# Altium schematic sheet fans.SchDoc: CS - Fan Switch
size Letter; CheckedBy: J. Brinton; CompanyName: Signal Laboratories, Inc.; DrawnBy: J. Brinton; Engineer: J. Brinton; Address1: 3479 Edison Way; Address2: Menlo Park CA 94025; Address3: +1 (877) 778-8435; Address4: siglabs.com; Revision: 3; SheetNumber: 46; SheetTotal: 47
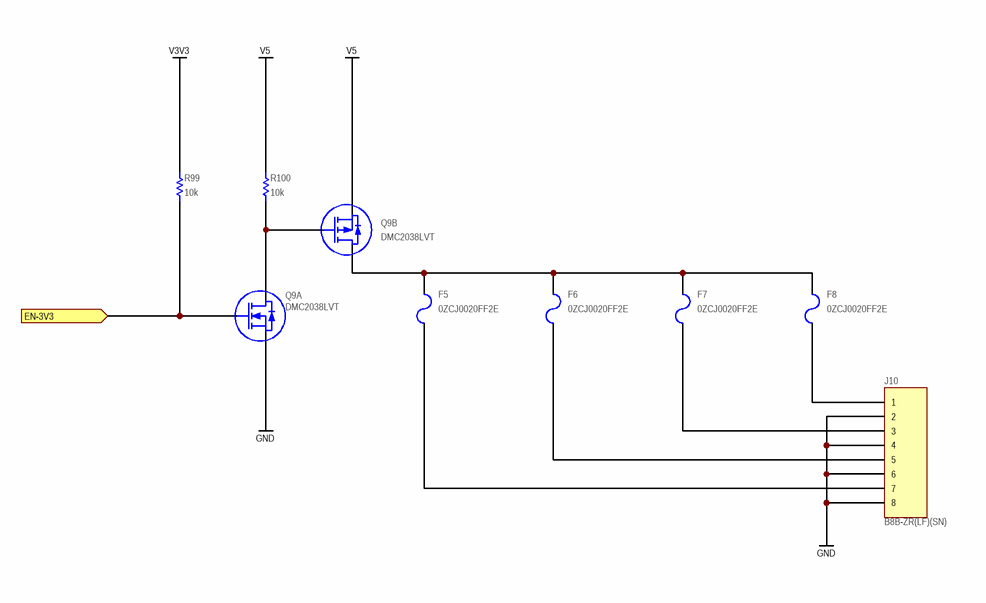
[diagram p0: fans.SchDoc]

## Parts
F5  0ZCJ0020FF2E  [1206]
F6  0ZCJ0020FF2E  [1206]
F7  0ZCJ0020FF2E  [1206]
F8  0ZCJ0020FF2E  [1206]
J10  B8B-ZR(LF)(SN)  [B8B-ZR]
Q9  DMC2038LVT  [TSOP-6]  (parts A,B of 2)
R99  value 10k  [RESC1005X40N]  (hidden comment: ERJ-2RKF1002X)
R100  value 10k  [RESC1005X40N]  (hidden comment: ERJ-2RKF1002X)

## Ports
EN-3V3 (in)

## Nets
GND: J10.2 J10.4 J10.6 J10.8 Q9.5(S)
V3V3: R99.2
V5: Q9.2(S) R100.2
EN-3V3: Q9.1(G) R99.1 ; port EN-3V3
NetF5_1: F5.1 F6.1 F7.1 F8.1 Q9.4(D)
NetF5_2: F5.2 J10.7
NetF6_2: F6.2 J10.5
NetF7_2: F7.2 J10.3
NetF8_2: F8.2 J10.1
NetQ9_3: Q9.3(G) Q9.6(D) R100.1

## Notes on the sheet
- Title
- Engineer
- Revision
- Drawn By
- Checked By
- Date
- Sheet
- of

## Library data of the parts
F5-F8 = 0ZCJ0020FF2E: PTC Resettable Fuse, 0.2A, 30V, SMD 1206; Manufacturer: Bell Fuse; Manufacturer P/N: 0ZCJ0020FF2E
J10 = Header 8: Through-hole Shrouded Header 8-Position; Manufacturer: JST; Manufacturer P/N: B8B-ZR(LF)(SN)
Q9 = DMC2038LVT: Complementary MOSFET Pair; Manufacturer: Diodes, Inc.; Manufacturer P/N: DMC2038LVT
R99 R100 = RES: Thick Film Resistor 10k ±1% 0.1W 50V 0402; Manufacturer: Panasonic; Tcr: ±100; Tr: -55:155; Voltage: 50; Power: 0.1; Manufacturer P/N: ERJ-2RKF1002X; Tolerance: ±1%; Alternatives: *; Footprint: *; Package: 0402